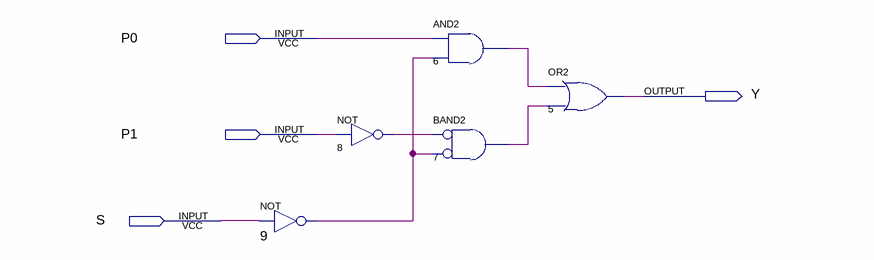
[diagram p0: schematic sheet]
// Quartus schematic Mux.bdf as structural Verilog: 5 symbols, 4 pins
module Mux (
  input  P0,
  input  P1,
  input  S,
  output Y
);

  wire n6_out, n7_out, n8_out, n9_out;

  not u_9 (n9_out, S);
  not u_8 (n8_out, P1);
  and u_6 (n6_out, P0, n9_out);
  and u_7 (n7_out, ~n8_out, ~n9_out);  // BAND2
  or u_5 (Y, n6_out, n7_out);
endmodule
